# Altium schematic sheet 30_HV_Connectors.SchDoc
size A4; SheetNumber: 4; SheetTotal: 4
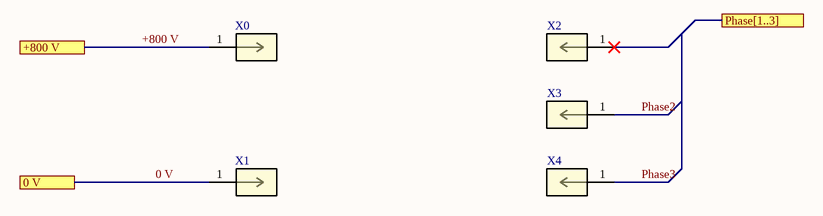
[diagram p0: 30_HV_Connectors.SchDoc]

## Parts
X0  1379-1  [CONN_1379-1_KEY]  (value not drawn)
X1  1379-1  [CONN_1379-1_KEY]  (value not drawn)
X2  1379-1  [CONN_1379-1_KEY]  (value not drawn)
X3  1379-1  [CONN_1379-1_KEY]  (value not drawn)
X4  1379-1  [CONN_1379-1_KEY]  (value not drawn)

## Ports
0 V (see 00_TopLevel, 10_Phase, 20_DC_Link), +800 V (see 00_TopLevel, 10_Phase, 20_DC_Link), Phase[1..3] (see 00_TopLevel)

## Nets
0 V: X1.1 ; port 0 V
+800 V: X0.1 ; port +800 V
Phase2: X3.1
Phase3: X4.1

Not connected (* = marked no-connect by the designer): X2 1*

## Library data of the parts
X0-X4 = 1379-1: Description; Manufacturer_Name: Keystone Electronics; Copyright: Copyright (C) 2025 Ultra Librarian. All rights reserved.; Manufacturer_Part_Number: 1379-1; RefDes: RefDes; Type: Type